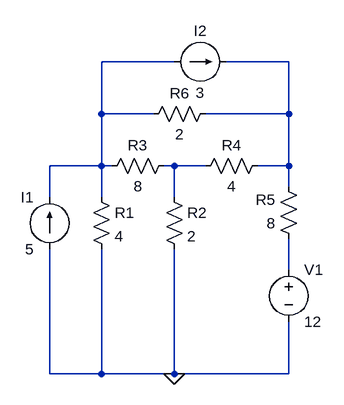
[diagram p0: schematic Draft23.asc]
Draft23.asc, the LTspice schematic file:
Version 4
SHEET 1 880 680
WIRE 240 -80 128 -80
WIRE 416 -80 320 -80
WIRE 128 0 128 -80
WIRE 208 0 128 0
WIRE 416 0 416 -80
WIRE 416 0 288 0
WIRE 128 80 128 0
WIRE 128 80 48 80
WIRE 144 80 128 80
WIRE 240 80 224 80
WIRE 288 80 240 80
WIRE 416 80 416 0
WIRE 416 80 368 80
WIRE 416 112 416 80
WIRE 48 128 48 80
WIRE 128 128 128 80
WIRE 240 128 240 80
WIRE 416 240 416 192
WIRE 48 400 48 208
WIRE 128 400 128 208
WIRE 128 400 48 400
WIRE 240 400 240 208
WIRE 240 400 128 400
WIRE 416 400 416 320
WIRE 416 400 240 400
FLAG 240 400 0
SYMBOL current 48 208 R180
WINDOW 0 24 80 Left 2
WINDOW 3 24 0 Left 2
SYMATTR InstName I1
SYMATTR Value 5
SYMBOL res 112 112 R0
SYMATTR InstName R1
SYMATTR Value 4
SYMBOL res 224 112 R0
SYMATTR InstName R2
SYMATTR Value 2
SYMBOL res 240 64 R90
WINDOW 0 0 56 VBottom 2
WINDOW 3 32 56 VTop 2
SYMATTR InstName R3
SYMATTR Value 8
SYMBOL res 384 64 R90
WINDOW 0 0 56 VBottom 2
WINDOW 3 32 56 VTop 2
SYMATTR InstName R4
SYMATTR Value 4
SYMBOL res 432 208 R180
WINDOW 0 36 76 Left 2
WINDOW 3 36 40 Left 2
SYMATTR InstName R5
SYMATTR Value 8
SYMBOL voltage 416 224 R0
SYMATTR InstName V1
SYMATTR Value 12
SYMBOL res 304 -16 R90
WINDOW 0 0 56 VBottom 2
WINDOW 3 32 56 VTop 2
SYMATTR InstName R6
SYMATTR Value 2
SYMBOL current 240 -80 R270
WINDOW 0 32 40 VTop 2
WINDOW 3 -32 40 VBottom 2
SYMATTR InstName I2
SYMATTR Value 3

The netlist it stands for:
* Draft23.asc
I1 0 N001 5
R1 N001 0 4
R2 N003 0 2
R3 N003 N001 8
R4 N002 N003 4
R5 N004 N002 8
V1 N004 0 12
R6 N002 N001 2
I2 N001 N002 3
.backanno
.end